# Altium schematic sheet HPCC_Connector_A.SchDoc: HPCC Connector A
size B; CheckedBy: Jason Sullins; Author: Jordan Harris-Toovy; Revision: 0.2; SheetNumber: 8; SheetTotal: 22; Size: ANSI B
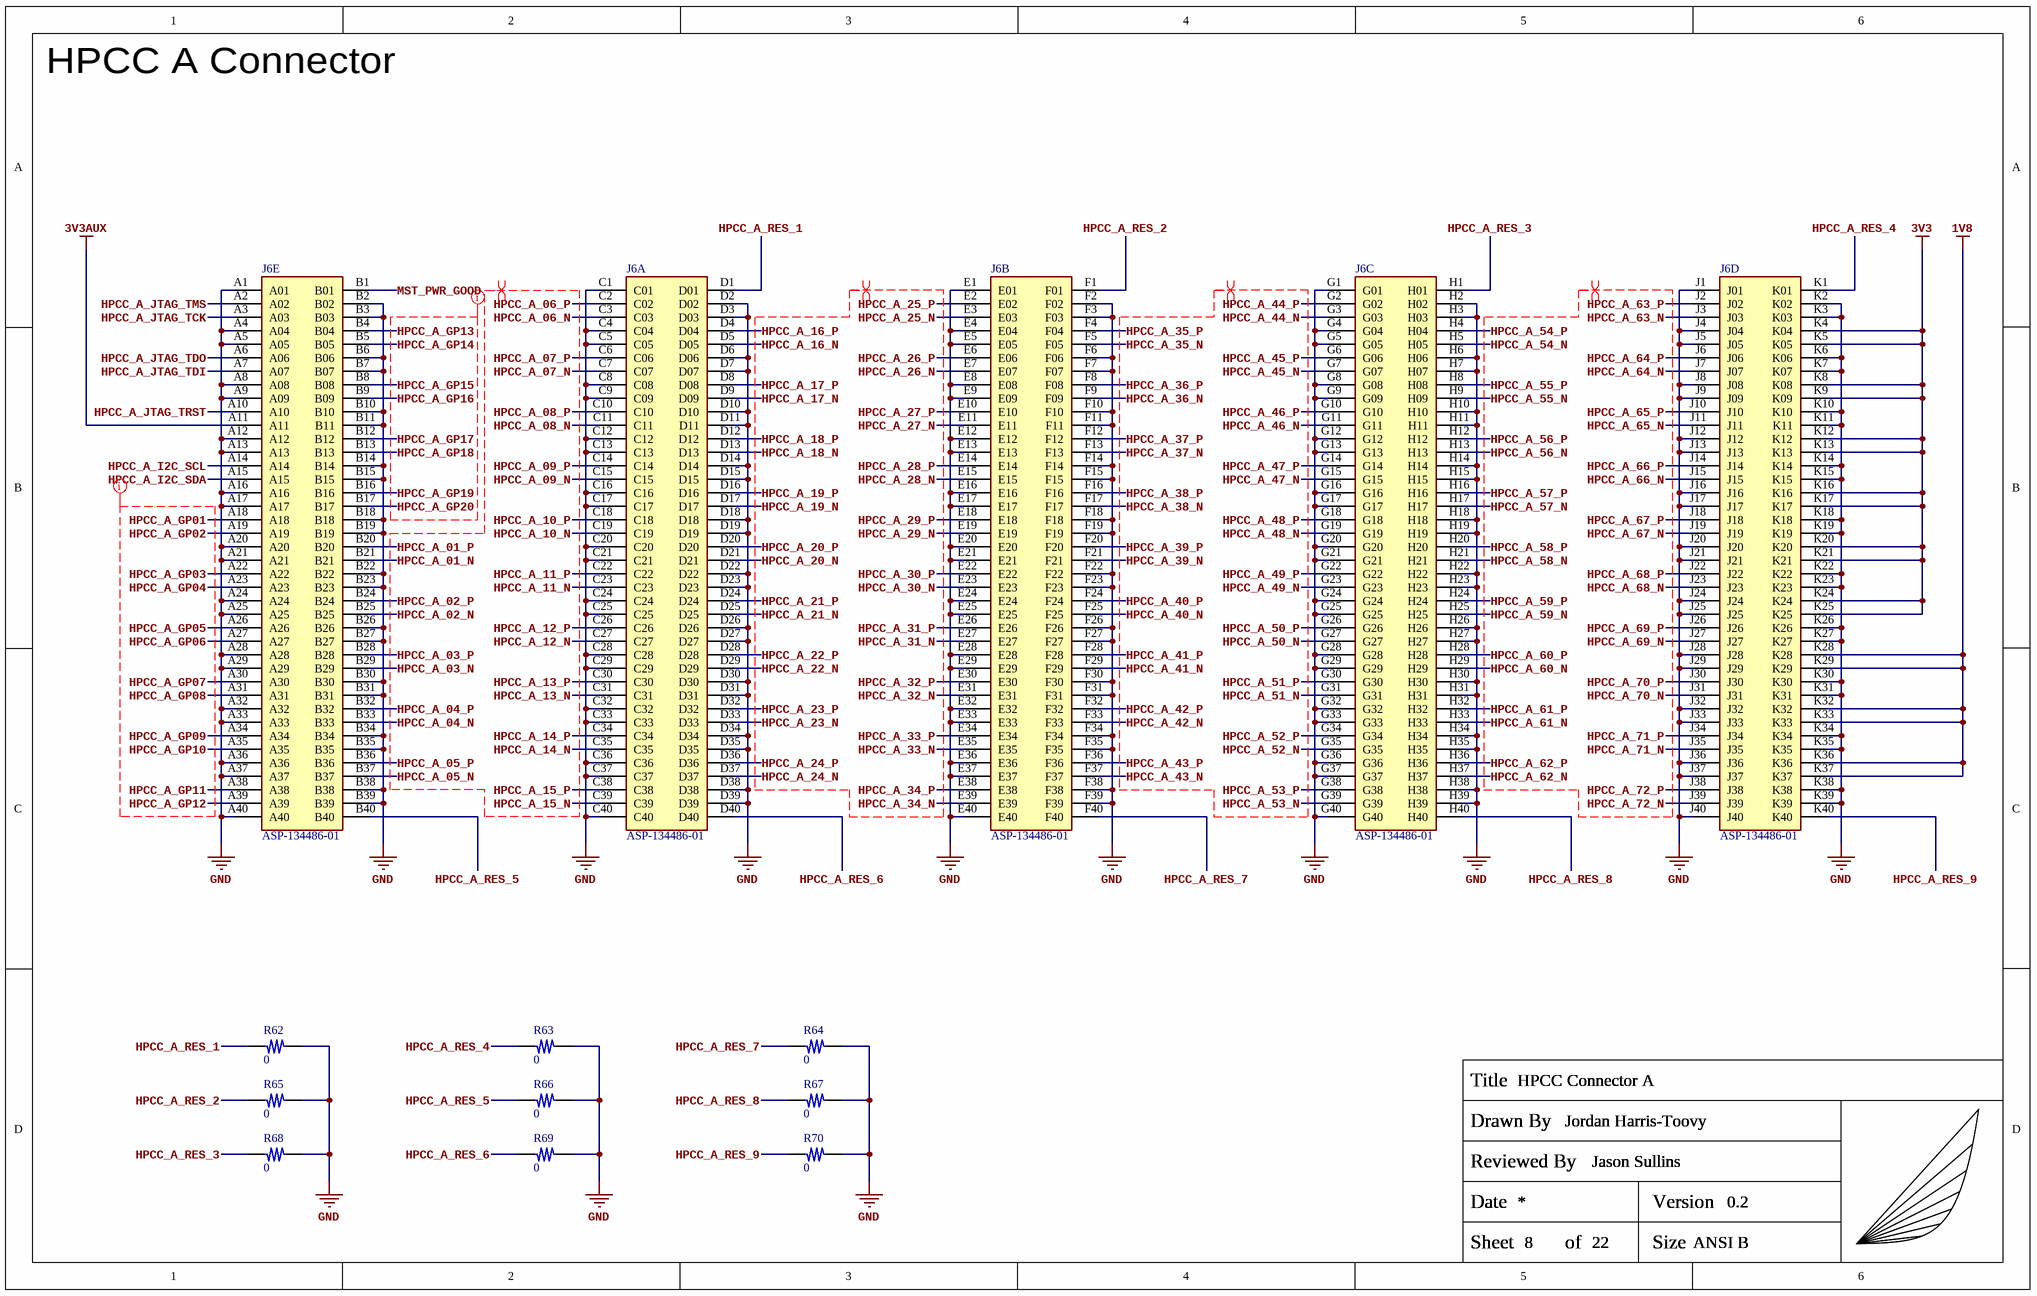
[diagram p0: HPCC_Connector_A.SchDoc]

## Parts
J6  ASP-134486-01  [SAMTEC_ASP-134486-01]  (parts A,B,C,D,E of 5)
R62  0  [R_0402_Generic]
R63  0  [R_0402_Generic]
R64  0  [R_0402_Generic]
R65  0  [R_0402_Generic]
R66  0  [R_0402_Generic]
R67  0  [R_0402_Generic]
R68  0  [R_0402_Generic]
R69  0  [R_0402_Generic]
R70  0  [R_0402_Generic]
TITLEBLOCK?  Capstone_Title_Block  (value not drawn)  (graphical)

## Nets
1V8: J6.K28 J6.K29 J6.K32 J6.K33 J6.K36 J6.K37
3V3: J6.K4(K04) J6.K5(K05) J6.K8(K08) J6.K9(K09) J6.K12 J6.K13 J6.K16 J6.K17 J6.K20 J6.K21 J6.K24 J6.K25
3V3AUX: J6.A11
GND: J6.A1(A01) J6.A4(A04) J6.A5(A05) J6.A8(A08) J6.A9(A09) J6.A12 J6.A13 J6.A16 J6.A17 J6.A20 J6.A21 J6.A24 J6.A25 J6.A28 J6.A29 J6.A32 J6.A33 J6.A36 J6.A37 J6.A40 J6.B2(B02) J6.B3(B03) J6.B6(B06) J6.B7(B07) J6.B10 J6.B11 J6.B14 J6.B15 J6.B18 J6.B19 J6.B22 J6.B23 J6.B26 J6.B27 J6.B30 J6.B31 J6.B34 J6.B35 J6.B38 J6.B39 J6.C1(C01) J6.C4(C04) J6.C5(C05) J6.C8(C08) J6.C9(C09) J6.C12 J6.C13 J6.C16 J6.C17 J6.C20 J6.C21 J6.C24 J6.C25 J6.C28 J6.C29 J6.C32 J6.C33 J6.C36 J6.C37 J6.C40 J6.D2(D02) J6.D3(D03) J6.D6(D06) J6.D7(D07) J6.D10 J6.D11 J6.D14 J6.D15 J6.D18 J6.D19 J6.D22 J6.D23 J6.D26 J6.D27 J6.D30 J6.D31 J6.D34 J6.D35 J6.D38 J6.D39 J6.E1(E01) J6.E4(E04) J6.E5(E05) J6.E8(E08) J6.E9(E09) J6.E12 J6.E13 J6.E16 J6.E17 J6.E20 J6.E21 J6.E24 J6.E25 J6.E28 J6.E29 J6.E32 J6.E33 J6.E36 J6.E37 J6.E40 J6.F2(F02) J6.F3(F03) J6.F6(F06) J6.F7(F07) J6.F10 J6.F11 J6.F14 J6.F15 J6.F18 J6.F19 J6.F22 J6.F23 J6.F26 J6.F27 J6.F30 J6.F31 J6.F34 J6.F35 J6.F38 J6.F39 J6.G1(G01) J6.G4(G04) J6.G5(G05) J6.G8(G08) J6.G9(G09) J6.G12 J6.G13 J6.G16 J6.G17 J6.G20 J6.G21 J6.G24 J6.G25 J6.G28 J6.G29 J6.G32 J6.G33 J6.G36 J6.G37 J6.G40 J6.H2(H02) J6.H3(H03) J6.H6(H06) J6.H7(H07) J6.H10 J6.H11 J6.H14 J6.H15 J6.H18 J6.H19 J6.H22 J6.H23 J6.H26 J6.H27 J6.H30 J6.H31 J6.H34 J6.H35 J6.H38 J6.H39 J6.J1(J01) J6.J4(J04) J6.J5(J05) J6.J8(J08) J6.J9(J09) J6.J12 J6.J13 J6.J16 J6.J17 J6.J20 J6.J21 J6.J24 J6.J25 J6.J28 J6.J29 J6.J32 J6.J33 J6.J36 J6.J37 J6.J40 J6.K2(K02) J6.K3(K03) J6.K6(K06) J6.K7(K07) J6.K10 J6.K11 J6.K14 J6.K15 J6.K18 J6.K19 J6.K22 J6.K23 J6.K26 J6.K27 J6.K30 J6.K31 J6.K34 J6.K35 J6.K38 J6.K39 R62.1 R63.1 R64.1 R65.1 R66.1 R67.1 R68.1 R69.1 R70.1
HPCC_A_01_N: J6.B21
HPCC_A_01_P: J6.B20
HPCC_A_02_N: J6.B25
HPCC_A_02_P: J6.B24
HPCC_A_03_N: J6.B29
HPCC_A_03_P: J6.B28
HPCC_A_04_N: J6.B33
HPCC_A_04_P: J6.B32
HPCC_A_05_N: J6.B37
HPCC_A_05_P: J6.B36
HPCC_A_06_N: J6.C3(C03)
HPCC_A_06_P: J6.C2(C02)
HPCC_A_07_N: J6.C7(C07)
HPCC_A_07_P: J6.C6(C06)
HPCC_A_08_N: J6.C11
HPCC_A_08_P: J6.C10
HPCC_A_09_N: J6.C15
HPCC_A_09_P: J6.C14
HPCC_A_10_N: J6.C19
HPCC_A_10_P: J6.C18
HPCC_A_11_N: J6.C23
HPCC_A_11_P: J6.C22
HPCC_A_12_N: J6.C27
HPCC_A_12_P: J6.C26
HPCC_A_13_N: J6.C31
HPCC_A_13_P: J6.C30
HPCC_A_14_N: J6.C35
HPCC_A_14_P: J6.C34
HPCC_A_15_N: J6.C39
HPCC_A_15_P: J6.C38
HPCC_A_16_N: J6.D5(D05)
HPCC_A_16_P: J6.D4(D04)
HPCC_A_17_N: J6.D9(D09)
HPCC_A_17_P: J6.D8(D08)
HPCC_A_18_N: J6.D13
HPCC_A_18_P: J6.D12
HPCC_A_19_N: J6.D17
HPCC_A_19_P: J6.D16
HPCC_A_20_N: J6.D21
HPCC_A_20_P: J6.D20
HPCC_A_21_N: J6.D25
HPCC_A_21_P: J6.D24
HPCC_A_22_N: J6.D29
HPCC_A_22_P: J6.D28
HPCC_A_23_N: J6.D33
HPCC_A_23_P: J6.D32
HPCC_A_24_N: J6.D37
HPCC_A_24_P: J6.D36
HPCC_A_25_N: J6.E3(E03)
HPCC_A_25_P: J6.E2(E02)
HPCC_A_26_N: J6.E7(E07)
HPCC_A_26_P: J6.E6(E06)
HPCC_A_27_N: J6.E11
HPCC_A_27_P: J6.E10
HPCC_A_28_N: J6.E15
HPCC_A_28_P: J6.E14
HPCC_A_29_N: J6.E19
HPCC_A_29_P: J6.E18
HPCC_A_30_N: J6.E23
HPCC_A_30_P: J6.E22
HPCC_A_31_N: J6.E27
HPCC_A_31_P: J6.E26
HPCC_A_32_N: J6.E31
HPCC_A_32_P: J6.E30
HPCC_A_33_N: J6.E35
HPCC_A_33_P: J6.E34
HPCC_A_34_N: J6.E39
HPCC_A_34_P: J6.E38
HPCC_A_35_N: J6.F5(F05)
HPCC_A_35_P: J6.F4(F04)
HPCC_A_36_N: J6.F9(F09)
HPCC_A_36_P: J6.F8(F08)
HPCC_A_37_N: J6.F13
HPCC_A_37_P: J6.F12
HPCC_A_38_N: J6.F17
HPCC_A_38_P: J6.F16
HPCC_A_39_N: J6.F21
HPCC_A_39_P: J6.F20
HPCC_A_40_N: J6.F25
HPCC_A_40_P: J6.F24
HPCC_A_41_N: J6.F29
HPCC_A_41_P: J6.F28
HPCC_A_42_N: J6.F33
HPCC_A_42_P: J6.F32
HPCC_A_43_N: J6.F37
HPCC_A_43_P: J6.F36
HPCC_A_44_N: J6.G3(G03)
HPCC_A_44_P: J6.G2(G02)
HPCC_A_45_N: J6.G7(G07)
HPCC_A_45_P: J6.G6(G06)
HPCC_A_46_N: J6.G11
HPCC_A_46_P: J6.G10
HPCC_A_47_N: J6.G15
HPCC_A_47_P: J6.G14
HPCC_A_48_N: J6.G19
HPCC_A_48_P: J6.G18
HPCC_A_49_N: J6.G23
HPCC_A_49_P: J6.G22
HPCC_A_50_N: J6.G27
HPCC_A_50_P: J6.G26
HPCC_A_51_N: J6.G31
HPCC_A_51_P: J6.G30
HPCC_A_52_N: J6.G35
HPCC_A_52_P: J6.G34
HPCC_A_53_N: J6.G39
HPCC_A_53_P: J6.G38
HPCC_A_54_N: J6.H5(H05)
HPCC_A_54_P: J6.H4(H04)
HPCC_A_55_N: J6.H9(H09)
HPCC_A_55_P: J6.H8(H08)
HPCC_A_56_N: J6.H13
HPCC_A_56_P: J6.H12
HPCC_A_57_N: J6.H17
HPCC_A_57_P: J6.H16
HPCC_A_58_N: J6.H21
HPCC_A_58_P: J6.H20
HPCC_A_59_N: J6.H25
HPCC_A_59_P: J6.H24
HPCC_A_60_N: J6.H29
HPCC_A_60_P: J6.H28
HPCC_A_61_N: J6.H33
HPCC_A_61_P: J6.H32
HPCC_A_62_N: J6.H37
HPCC_A_62_P: J6.H36
HPCC_A_63_N: J6.J3(J03)
HPCC_A_63_P: J6.J2(J02)
HPCC_A_64_N: J6.J7(J07)
HPCC_A_64_P: J6.J6(J06)
HPCC_A_65_N: J6.J11
HPCC_A_65_P: J6.J10
HPCC_A_66_N: J6.J15
HPCC_A_66_P: J6.J14
HPCC_A_67_N: J6.J19
HPCC_A_67_P: J6.J18
HPCC_A_68_N: J6.J23
HPCC_A_68_P: J6.J22
HPCC_A_69_N: J6.J27
HPCC_A_69_P: J6.J26
HPCC_A_70_N: J6.J31
HPCC_A_70_P: J6.J30
HPCC_A_71_N: J6.J35
HPCC_A_71_P: J6.J34
HPCC_A_72_N: J6.J39
HPCC_A_72_P: J6.J38
HPCC_A_GP01: J6.A18
HPCC_A_GP02: J6.A19
HPCC_A_GP03: J6.A22
HPCC_A_GP04: J6.A23
HPCC_A_GP05: J6.A26
HPCC_A_GP06: J6.A27
HPCC_A_GP07: J6.A30
HPCC_A_GP08: J6.A31
HPCC_A_GP09: J6.A34
HPCC_A_GP10: J6.A35
HPCC_A_GP11: J6.A38
HPCC_A_GP12: J6.A39
HPCC_A_GP13: J6.B4(B04)
HPCC_A_GP14: J6.B5(B05)
HPCC_A_GP15: J6.B8(B08)
HPCC_A_GP16: J6.B9(B09)
HPCC_A_GP17: J6.B12
HPCC_A_GP18: J6.B13
HPCC_A_GP19: J6.B16
HPCC_A_GP20: J6.B17
HPCC_A_I2C_SCL: J6.A14
HPCC_A_I2C_SDA: J6.A15
HPCC_A_JTAG_TCK: J6.A3(A03)
HPCC_A_JTAG_TDI: J6.A7(A07)
HPCC_A_JTAG_TDO: J6.A6(A06)
HPCC_A_JTAG_TMS: J6.A2(A02)
HPCC_A_JTAG_TRST: J6.A10
HPCC_A_RES_1: J6.D1(D01) R62.2
HPCC_A_RES_2: J6.F1(F01) R65.2
HPCC_A_RES_3: J6.H1(H01) R68.2
HPCC_A_RES_4: J6.K1(K01) R63.2
HPCC_A_RES_5: J6.B40 R66.2
HPCC_A_RES_6: J6.D40 R69.2
HPCC_A_RES_7: J6.F40 R64.2
HPCC_A_RES_8: J6.H40 R67.2
HPCC_A_RES_9: J6.K40 R70.2
MST_PWR_GOOD: J6.B1(B01)

## Layout directives
differential pair; differential pair class DP100_HPCC_A: HPCC_A_01_N, HPCC_A_01_P, HPCC_A_02_N, HPCC_A_02_P, HPCC_A_03_N, HPCC_A_03_P, HPCC_A_04_N, HPCC_A_04_P, HPCC_A_05_N, HPCC_A_05_P, HPCC_A_06_N, HPCC_A_06_P, HPCC_A_07_N, HPCC_A_07_P, HPCC_A_08_N, HPCC_A_08_P, HPCC_A_09_N, HPCC_A_09_P, HPCC_A_10_N, HPCC_A_10_P, HPCC_A_11_N, HPCC_A_11_P, HPCC_A_12_N, HPCC_A_12_P, HPCC_A_13_N, HPCC_A_13_P, HPCC_A_14_N, HPCC_A_14_P, HPCC_A_15_N, HPCC_A_15_P, HPCC_A_16_N, HPCC_A_16_P, HPCC_A_17_N, HPCC_A_17_P, HPCC_A_18_N, HPCC_A_18_P, HPCC_A_19_N, HPCC_A_19_P, HPCC_A_20_N, HPCC_A_20_P, HPCC_A_21_N, HPCC_A_21_P, HPCC_A_22_N, HPCC_A_22_P, HPCC_A_23_N, HPCC_A_23_P, HPCC_A_24_N, HPCC_A_24_P, HPCC_A_25_N, HPCC_A_25_P, HPCC_A_26_N, HPCC_A_26_P, HPCC_A_27_N, HPCC_A_27_P, HPCC_A_28_N, HPCC_A_28_P, HPCC_A_29_N, HPCC_A_29_P, HPCC_A_30_N, HPCC_A_30_P, HPCC_A_31_N, HPCC_A_31_P, HPCC_A_32_N, HPCC_A_32_P, HPCC_A_33_N, HPCC_A_33_P, HPCC_A_34_N, HPCC_A_34_P, HPCC_A_35_N, HPCC_A_35_P, HPCC_A_36_N, HPCC_A_36_P, HPCC_A_37_N, HPCC_A_37_P, HPCC_A_38_N, HPCC_A_38_P, HPCC_A_39_N, HPCC_A_39_P, HPCC_A_40_N, HPCC_A_40_P, HPCC_A_41_N, HPCC_A_41_P, HPCC_A_42_N, HPCC_A_42_P, HPCC_A_43_N, HPCC_A_43_P, HPCC_A_44_N, HPCC_A_44_P, HPCC_A_45_N, HPCC_A_45_P, HPCC_A_46_N, HPCC_A_46_P, HPCC_A_47_N, HPCC_A_47_P, HPCC_A_48_N, HPCC_A_48_P, HPCC_A_49_N, HPCC_A_49_P, HPCC_A_50_N, HPCC_A_50_P, HPCC_A_51_N, HPCC_A_51_P, HPCC_A_52_N, HPCC_A_52_P, HPCC_A_53_N, HPCC_A_53_P, HPCC_A_54_N, HPCC_A_54_P, HPCC_A_55_N, HPCC_A_55_P, HPCC_A_56_N, HPCC_A_56_P, HPCC_A_57_N, HPCC_A_57_P, HPCC_A_58_N, HPCC_A_58_P, HPCC_A_59_N, HPCC_A_59_P, HPCC_A_60_N, HPCC_A_60_P, HPCC_A_61_N, HPCC_A_61_P, HPCC_A_62_N, HPCC_A_62_P, HPCC_A_63_N, HPCC_A_63_P, HPCC_A_64_N, HPCC_A_64_P, HPCC_A_65_N, HPCC_A_65_P, HPCC_A_66_N, HPCC_A_66_P, HPCC_A_67_N, HPCC_A_67_P, HPCC_A_68_N, HPCC_A_68_P, HPCC_A_69_N, HPCC_A_69_P, HPCC_A_70_N, HPCC_A_70_P, HPCC_A_71_N, HPCC_A_71_P, HPCC_A_72_N, HPCC_A_72_P
net class SE50_HPCC_A: HPCC_A_GP01, HPCC_A_GP02, HPCC_A_GP03, HPCC_A_GP04, HPCC_A_GP05, HPCC_A_GP06, HPCC_A_GP07, HPCC_A_GP08, HPCC_A_GP09, HPCC_A_GP10, HPCC_A_GP11, HPCC_A_GP12, HPCC_A_GP13, HPCC_A_GP14, HPCC_A_GP15, HPCC_A_GP16, HPCC_A_GP17, HPCC_A_GP18, HPCC_A_GP19, HPCC_A_GP20

## Notes on the sheet
- HPCC A Connector
- (in symbol Capstone_Title_Block) Title; Drawn By; Reviewed By; Date; Version; Sheet; of; Size

## Library data of the parts
J6 = ASP-134486-01: 400 Position Connector Array, Female Sockets Surface Mount Gold; Manufacturer: Samtec; Manufacturer Part Number: ASP-134486-01
R62-R70 = ERJ-2GE0R00X: Jumper 0Ohm SMD resistor in 0402 size; Manufacturer: Panasonic; Manufacturer Part Number: ERJ-2GE0R00X
TITLEBLOCK? = Capstone_Title_Block: Custom title block with personal logo; Manufacturer: NONE; Manufacturer Part Number: NONE